# Altium schematic sheet THS7002CPWP_Schematic.SchDoc
size A; SheetNumber: 3; SheetTotal: 3
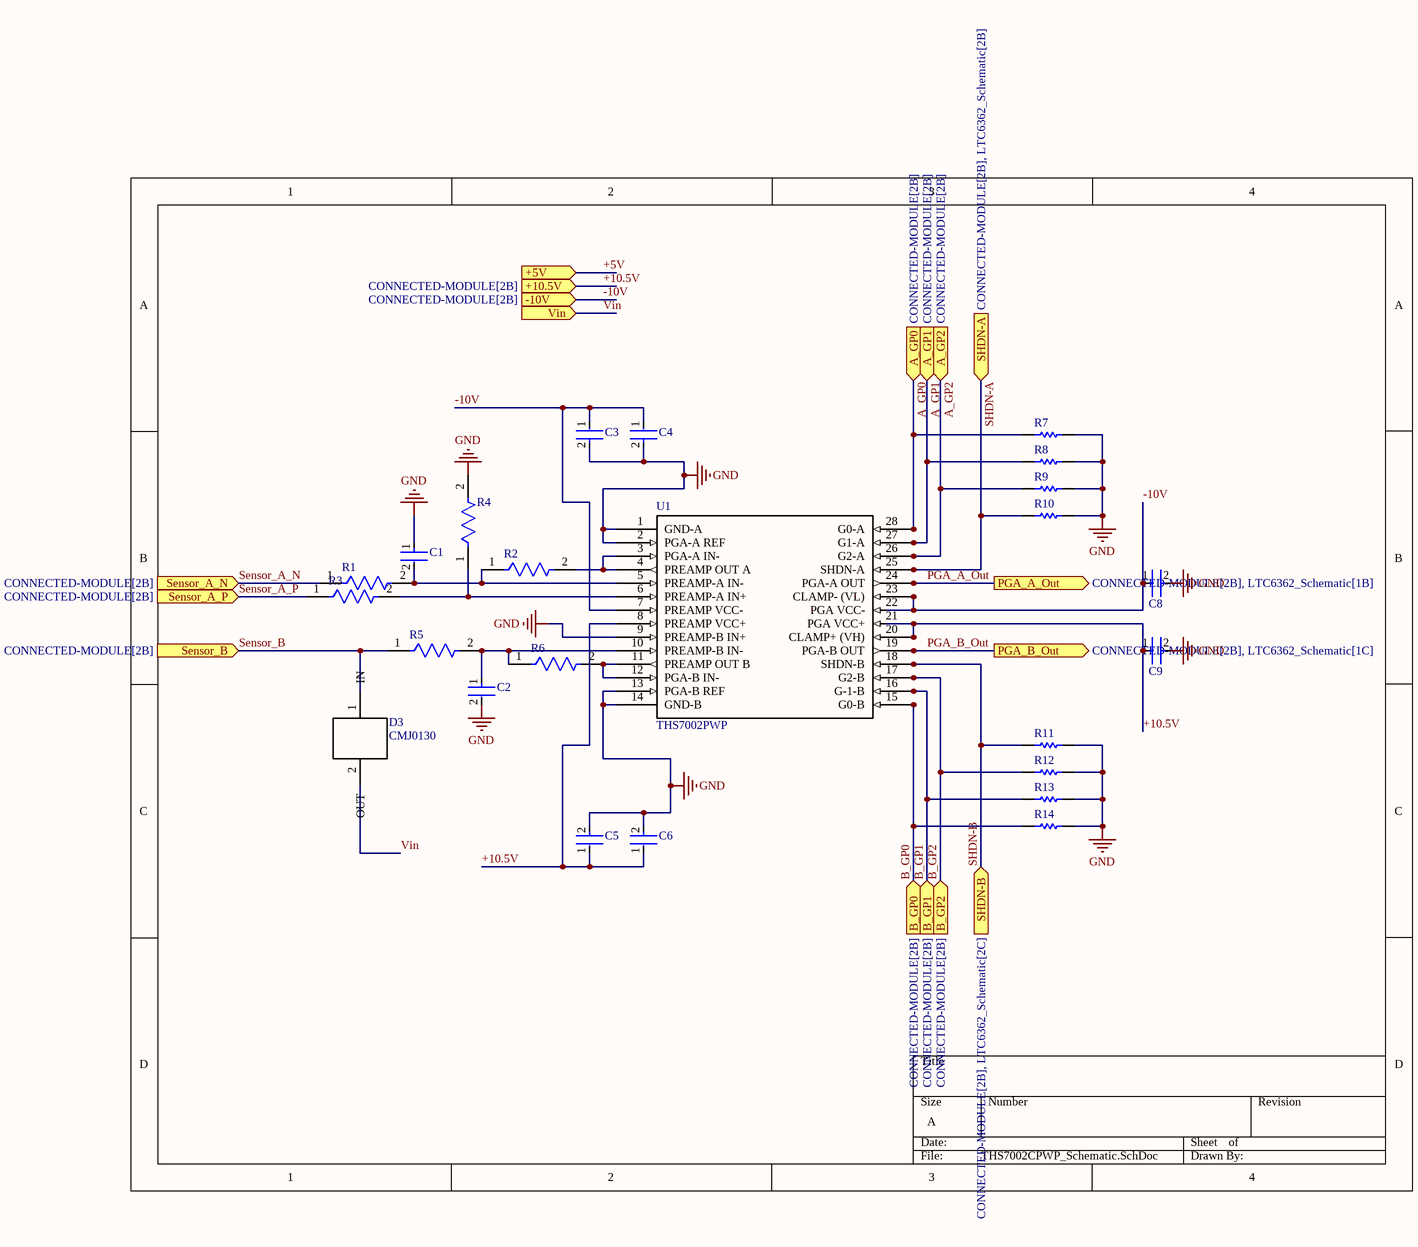
[diagram p0: THS7002CPWP_Schematic.SchDoc]

## Parts
C1  GRM1557U1A302JA01D  [FP-GRM155-0_05-IPC_B]  (value not drawn)
C2  C0603C622J5GACTU  [FP-C0603C-CF-MFG]  (value not drawn)
C3  GRM155R71C104KA88D  [FP-GRM15-MFG]  (value not drawn)
C4  C1608X5R1A685K080AC  [FP-C1608-080-0_1-IPC_B]  (value not drawn)
C5  GRM155R71C104KA88D  [FP-GRM15-MFG]  (value not drawn)
C6  C1608X5R1A685K080AC  [FP-C1608-080-0_1-IPC_B]  (value not drawn)
C8  GRM155R71C104KA88D  [FP-GRM15-MFG]  (value not drawn)
C9  GRM155R71C104KA88D  [FP-GRM15-MFG]  (value not drawn)
D3  CMJ0130  [CMJ2000_Footprint]
R1  CRCW0402499RFKED  [FP-CRCW0402-e3-IPC_A]  (value not drawn)
R2  CRCW0402499RFKED  [FP-CRCW0402-e3-IPC_A]  (value not drawn)
R3  CRCW0402499RFKED  [FP-CRCW0402-e3-IPC_A]  (value not drawn)
R4  CRCW0402499RFKED  [FP-CRCW0402-e3-IPC_A]  (value not drawn)
R5  CRCW0402499RFKED  [FP-CRCW0402-e3-IPC_A]  (value not drawn)
R6  CRCW0402499RFKED  [FP-CRCW0402-e3-IPC_A]  (value not drawn)
R7  ERJ-2RKF3301X  [RESC1005X40X25ML05T05]  (value not drawn)
R8  ERJ-2RKF3301X  [RESC1005X40X25ML05T05]  (value not drawn)
R9  ERJ-2RKF3301X  [RESC1005X40X25ML05T05]  (value not drawn)
R10  ERJ-2RKF3301X  [RESC1005X40X25ML05T05]  (value not drawn)
R11  ERJ-2RKF3301X  [RESC1005X40X25ML05T05]  (value not drawn)
R12  ERJ-2RKF3301X  [RESC1005X40X25ML05T05]  (value not drawn)
R13  ERJ-2RKF3301X  [RESC1005X40X25ML05T05]  (value not drawn)
R14  ERJ-2RKF3301X  [RESC1005X40X25ML05T05]  (value not drawn)
U1  THS7002PWP  [PWP0028E_N]

## Ports
+5V (in), +10.5V (in, see CONNECTED-MODULE[2B]), -10V (in, see CONNECTED-MODULE[2B]), A_GP0 (in, see CONNECTED-MODULE[2B]), A_GP1 (in, see CONNECTED-MODULE[2B]), A_GP2 (in, see CONNECTED-MODULE[2B]), B_GP0 (in, see CONNECTED-MODULE[2B]), B_GP1 (in, see CONNECTED-MODULE[2B]), B_GP2 (in, see CONNECTED-MODULE[2B]), PGA_A_Out (out, see CONNECTED-MODULE[2B], LTC6362_Schematic[1B]), PGA_B_Out (out, see CONNECTED-MODULE[2B], LTC6362_Schematic[1C]), Sensor_A_N (in, see CONNECTED-MODULE[2B]), Sensor_A_P (in, see CONNECTED-MODULE[2B]), Sensor_B (in, see CONNECTED-MODULE[2B]), SHDN-A (in, see CONNECTED-MODULE[2B], LTC6362_Schematic[2B]), SHDN-B (in, see CONNECTED-MODULE[2B], LTC6362_Schematic[2C]), Vin (in)

## Nets
GND: C1.1 C2.2 C3.2 C4.2 C5.2 C6.2 C8.2 C9.2 R4.2 R7.2 R8.2 R9.2 R10.2 R11.2 R12.2 R13.2 R14.2 U1.1(GND-A) U1.2(PGA-A_REF) U1.9(PREAMP-B_IN+) U1.13(PGA-B_REF) U1.14(GND-B)
+5V: port +5V
+10.5V: C5.1 C6.1 C9.1 U1.8(PREAMP_VCC+) U1.20(CLAMP+_(VH)) U1.21(PGA_VCC+) ; port +10.5V
-10V: C3.1 C4.1 C8.1 U1.7(PREAMP_VCC-) U1.22(PGA_VCC-) U1.23(CLAMP-_(VL)) ; port -10V
A_GP0: R7.1 U1.28(G0-A) ; port A_GP0
A_GP1: R8.1 U1.27(G1-A) ; port A_GP1
A_GP2: R9.1 U1.26(G2-A) ; port A_GP2
B_GP0: R14.1 U1.15(G0-B) ; port B_GP0
B_GP1: R13.1 U1.16(G-1-B) ; port B_GP1
B_GP2: R12.1 U1.17(G2-B) ; port B_GP2
PGA_A_Out: U1.24(PGA-A_OUT) ; port PGA_A_Out
PGA_B_Out: U1.19(PGA-B_OUT) ; port PGA_B_Out
Sensor_A_N: R1.1 ; port Sensor_A_N
Sensor_A_P: R3.1 ; port Sensor_A_P
Sensor_B: R5.1 ; port Sensor_B
SHDN-A: R10.1 U1.25(SHDN-A) ; port SHDN-A
SHDN-B: R11.1 U1.18(SHDN-B) ; port SHDN-B
Vin: port Vin
NetC1_2: C1.2 R1.2 R2.1 U1.5(PREAMP-A_IN-)
NetC2_1: C2.1 R5.2 R6.1 U1.10(PREAMP-B_IN-)
NetR2_2: R2.2 U1.3(PGA-A_IN-) U1.4(PREAMP_OUT_A)
NetR3_2: R3.2 R4.1 U1.6(PREAMP-A_IN+)
NetR6_2: R6.2 U1.11(PREAMP_OUT_B) U1.12(PGA-B_IN-)

Not connected (* = marked no-connect by the designer): D3 1(IN) 2(OUT)

## Library data of the parts
C1 = CMP-2008-04488-2: Chip Multilayer Ceramic Capacitors for General Purpose, 0402, 3000pF, U2J, -750ppm/°C, 5%, 10V; Capacitance: 3nF; Termination: SMD/SMT; Case Code (Imperial): 0402; Radiation Hardening: No; Mount: Surface Mount; Tolerance: 5%; Packaging: Tape and Reel; Thickness: 0.022inch; Max Operating Temperature: 125°C; Length: 1mm; Min Operating Temperature: -55°C; Voltage Rating (DC): 10V; Dielectric: U2J; Depth: 0.5mm; Lead Free: Lead Free; Width: 0.5mm; Package Quantity: 10000; Height: 0.5mm; Case Code (Metric): 1005; Voltage Rating: 10V; Case/Package: 0402
C2 = CMP-1035-02247-3: Multilayer Ceramic Capacitor, C Series, 6200 Pf, - 5%, C0g / Np0, 50 V, 0603 [1608 Metric] Rohs Compliant: Yes; Manufacturer: KEMET; Voltage Rating: 50 V; Capacitance: 6,200 pF; Automotive Grade: Grade 1; Value: 6,200 pF; Temperature Coefficient: 30ppm/°C; Tolerance: 0.05; Device Class L1: Passive Components; Temperature Range Low: -55°C; Temperature Range High: +125°C; Height: 0.87mm; Temperature Characteristic: C0G; ComponentLink2URL: https://api.kemet.com/component-edge/download/datasheet/C0603C100J5GACAUTO.pdf; RoHS: TRUE; Lead Free: Yes; Material: Ceramic; Category: Cap; Package: C0603C-CF; Octopart: https://octopart.com/c0603c622j5gactu-kemet-19757383; Device Class L3: Ceramic Capacitors; Automotive: Yes; Temperature: -55°C to +125°C; Mouser Description: Multilayer Ceramic Capacitors MLCC - SMD/SMT 50volts 6200pF 5% C0G; Digikey Description: Multilayer Ceramic Capacitor, C Series, 6200 Pf, - 5%, C0g / Np0, 50 V, 0603 [1608 Metric] Rohs Compliant: Yes; Device Class L2: Capacitors; Manufacturer Part Number: C0603C622J5GACTU; ComponentLink2Description: Datasheet
C3 C5 C8 C9 = CMP-2100-03641-2: CAP CER 0.1UF 16V X7R 0402; Manufacturer: Murata; Standoff Height: 0mm; Tolerance: 10%; Voltage Rating: 16Vdc; Material: Ceramic; Capacitance: 0.10μF; Value: 0.10μF; RoHS: TRUE; Manufacturer Part Number: GRM155R71C104KA88D; Temperature Characteristic: X7R; Octopart: https://octopart.com/grm155r71c104ka88d-murata-196880; Digikey Description: CAP CER 0.1UF 16V X7R 0402; Device Class L3: Ceramic Capacitors; Height: 0.55mm; ComponentLink2Description: Datasheet; Temperature Range Low: -55°C; Ipc Land Pattern Name: CAPC10050X219; ComponentLink2URL: https://search.murata.co.jp/Ceramy/image/img/A01X/G101/ENG/GRM155R71H471KA01-01A.pdf; Device Class L1: Passive Components; Lead Free: yes; Category: Cap; Package: GRM15; Temperature: -55°C to +125°C; Device Class L2: Capacitors; Temperature Range High: +125°C; Mouser Description: 0402 0.1 uF 16V ±10 % Tolerance X7R SMT Multilayer Ceramic Capacitor
C4 C6 = CMP-08246-004364-1: Multilayer Ceramic Capacitors 6.8μF ±10% 10V X5R SMD 0603; Capacitance: 6.8uF; Construction: Flat; Depth: 0.8mm; Case Code (Imperial): 0603; Min Operating Temperature: -55°C; Dielectric: X5R; Lead Free: Lead Free; Termination: SMD/SMT; REACH SVHC: No SVHC; Tolerance: 10%; Voltage Rating: 10V; Packaging: Tape and Reel; Dielectric Material: Ceramic; Width: 0.031inch; Length: 1.6mm; Height: 0.8mm; Mount: Surface Mount; Thickness: 0.035inch; Max Operating Temperature: 85°C; Case Code (Metric): 1608; Series: C; Voltage Rating (DC): 10V; Package Quantity: 1; Case/Package: 0603; Weight: 7.1E-05oz; RoHS Compliant: Yes
D3 = CMJ2000/0130: CMJ2000: DIODE CUR REG 100V 2.32MA 500MW; CMJ0130 DIODE CUR REG 100V 0.5mA 500MW; ComponentLink1Description: New link; ComponentLink1URL: *
R1-R6 = CMP-2002-00037-2: RES Thick Film, 499Ω, 1%, 0.063W, 100ppm/°C, 0402; Voltage Rating: 50V; Resistance: 499R; Max Power Dissipation: 63mW; Max Operating Temperature: 155°C; Termination: SMD/SMT; Working Voltage: 50V; Case/Package: 0402; Case Code (Imperial): 0402; Radiation Hardening: No; Contact Plating: Tin; Weight: 2.3E-05oz; Height: 0.35mm; Packaging: Tape and Reel; Temperature Coefficient: 100ppm/°C; Min Operating Temperature: -55°C; Lead Free: Lead Free; Tolerance: 1%; Case Code (Metric): 1005; Composition: Thick Film; Mount: Surface Mount; Depth: 0.5mm; Number of Terminations: 2; Power Rating: 63mW; Width: 0.02inch; Voltage Rating (DC): 50V; Package Quantity: 10; Features: Automotive AEC-Q200; Military Standard: Not; Length: 1mm
R7-R14 = CMP-1011-00567-3: Chip Resistor, 3.3 KOhm, +/- 1%, 0.1 W, -55 to 155 degC, 0402 (1005 Metric), RoHS, Tape and Reel; Manufacturer: Panasonic; Max Power Dissipation: 100mW; Voltage Rating: 50V; Temperature Coefficient: 100ppm/degreesC; Case Code (Metric): 1005; Max Operating Temperature: 155degC; Contact Plating: Tin; Power Rating: 100mW; Datasheet URL: https://industrial.panasonic.com/cdbs/www-data/pdf/RDA0000/AOA0000C283.pdf; Length: 1mm; Tolerance: 1%; REACH SVHC: NoSVHC; Depth: 0.5mm; Composition: ThickFilm; Package Description: 2-Pin Surface Mount Device, Body 1 x 0.5 mm; Case Code (Imperial): 0402; Lead Free: LeadFree; Manufacturer URL: http://www.panasonic.com/; Datasheet Version: 42095.0; Packaging: TapeandReel; Termination: SMD/SMT; RoHSCompliant: true; Height: 0.35mm; Military Standard: Not; Case/Package: 0402; Voltage Rating (DC): 50V; Radiation Hardening: No; Mount: SurfaceMount; Width: 0.02inch; Package Reference: 0402; Resistance: 3.3KOhm; Min Operating Temperature: -55degC; Number of Terminations: 2; Package Quantity: 1; Number of Pins: 2
U1 = Component_1